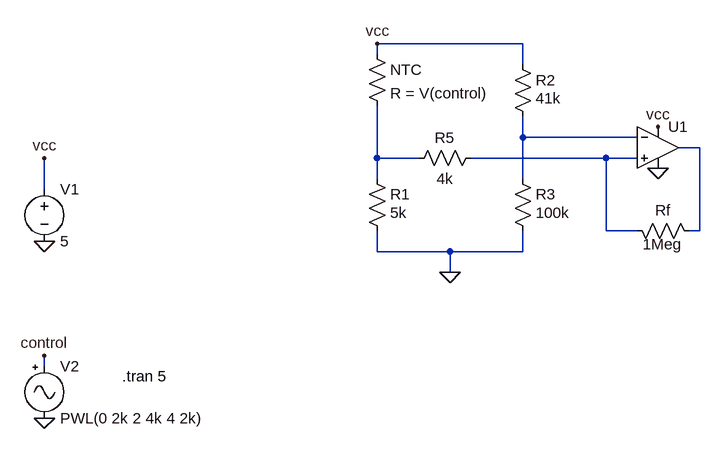
[diagram p0: schematic Ex5.asc]
Ex5.asc, the LTspice schematic file:
Version 4
SHEET 1 4004 680
WIRE 720 -80 496 -80
WIRE 496 -64 496 -80
WIRE 720 -48 720 -80
WIRE 720 64 720 32
WIRE 896 64 720 64
WIRE 992 80 960 80
WIRE 496 96 496 16
WIRE 560 96 496 96
WIRE 848 96 640 96
WIRE 896 96 848 96
WIRE 496 128 496 96
WIRE 720 128 720 64
WIRE -16 144 -16 96
WIRE 848 208 848 96
WIRE 896 208 848 208
WIRE 992 208 992 80
WIRE 992 208 976 208
WIRE 496 240 496 208
WIRE 608 240 496 240
WIRE 720 240 720 208
WIRE 720 240 608 240
WIRE 608 272 608 240
WIRE -16 416 -16 400
FLAG -16 224 0
FLAG -16 96 vcc
FLAG 928 48 vcc
FLAG 928 112 0
FLAG 608 272 0
FLAG 496 -80 vcc
FLAG -16 496 0
FLAG -16 400 control
SYMBOL Voltage -16 128 R0
SYMATTR InstName V1
SYMATTR Value 5
SYMBOL res 992 224 M270
WINDOW 0 32 56 VTop 2
WINDOW 3 -20 57 VTop 2
SYMATTR InstName Rf
SYMATTR Value 1Meg
SYMBOL res 704 -64 R0
WINDOW 3 36 68 Left 2
SYMATTR Value 41k
SYMATTR InstName R2
SYMBOL res 704 112 R0
WINDOW 3 36 68 Left 2
SYMATTR Value 100k
SYMATTR InstName R3
SYMBOL res 480 112 R0
WINDOW 3 36 68 Left 2
SYMATTR Value 5k
SYMATTR InstName R1
SYMBOL res 480 -80 R0
SYMATTR InstName NTC
SYMATTR Value R = V(control)
SYMBOL signal -16 400 R0
WINDOW 123 0 0 Left 0
WINDOW 39 0 0 Left 0
SYMATTR InstName V2
SYMATTR Value PWL(0 2k 2 4k 4 2k)
SYMBOL UniversalOpAmp2 928 80 R0
SYMATTR InstName U1
SYMBOL res 656 80 R90
WINDOW 0 0 56 VBottom 2
WINDOW 3 32 56 VTop 2
SYMATTR InstName R5
SYMATTR Value 4k
TEXT 104 432 Left 2 !.tran 5

The netlist it stands for:
* Ex5.asc
V1 vcc 0 5
Rf N002 N004 1Meg
R2 vcc N001 41k
R3 N001 0 100k
R1 N003 0 5k
R§NTC vcc N003 R = V(control)
V2 control 0 PWL(0 2k 2 4k 4 2k)
XU1 N004 N001 vcc 0 N002 level2 Avol=1Meg GBW=10Meg Slew=10Meg Ilimit=25m Rail=0 Vos=0 En=0 Enk=0 In=0 Ink=0 Rin=500Meg  ; pins In+ In- V+ V- OUT
R5 N004 N003 4k
.tran 5
.lib UniversalOpAmp2.lib
.backanno
.end